# Altium schematic sheet BV10011_ControlPower.SchDoc: Power supply
size A4; SheetNumber: 2; SheetTotal: 6
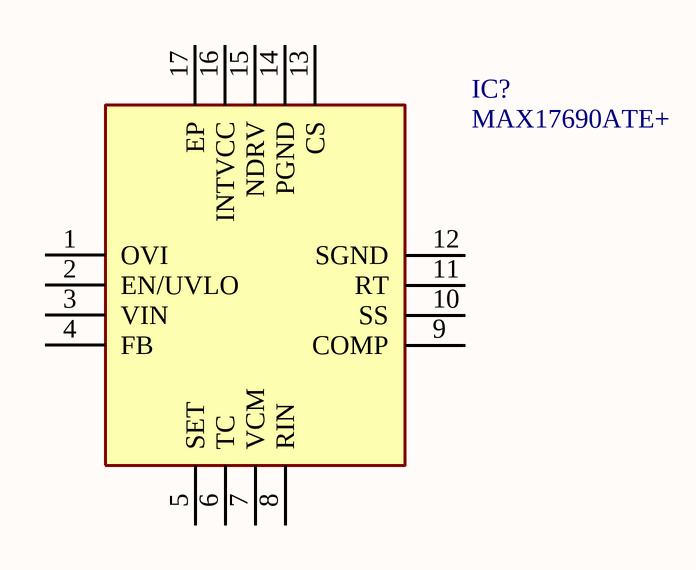
[diagram p0: BV10011_ControlPower.SchDoc]

## Parts
IC?  MAX17690ATE+  [QFN50P300X300X80-17N]

## Nets

Not connected (* = marked no-connect by the designer): IC? 1(OVI) 2(EN/UVLO) 3(VIN) 4(FB) 5(SET) 6(TC) 7(VCM) 8(RIN) 9(COMP) 10(SS) 11(RT) 12(SGND) 13(CS) 14(PGND) 15(NDRV) 16(INTVCC) 17(EP)

## Notes on the sheet
- Title
- Size:
- Date:
- A4
- Number:
- Time:
- Revision:
- Sheet
- of
- File:

## Library data of the parts
IC? = MAX17690ATE+: Integrated Circuit; Manufacturer_Name: Maxim Integrated; Datasheet Link: https://componentsearchengine.com/Datasheets/1/MAX17690ATE+.pdf; Height: 0.8mm; Mouser Part Number: 700-MAX17690ATE+; Mouser Price/Stock: https://www.mouser.com/Search/Refine.aspx?Keyword=700-MAX17690ATE%2B; Manufacturer_Part_Number: MAX17690ATE+